# EAGLE design lineFollower (EAGLE 6.5.0)
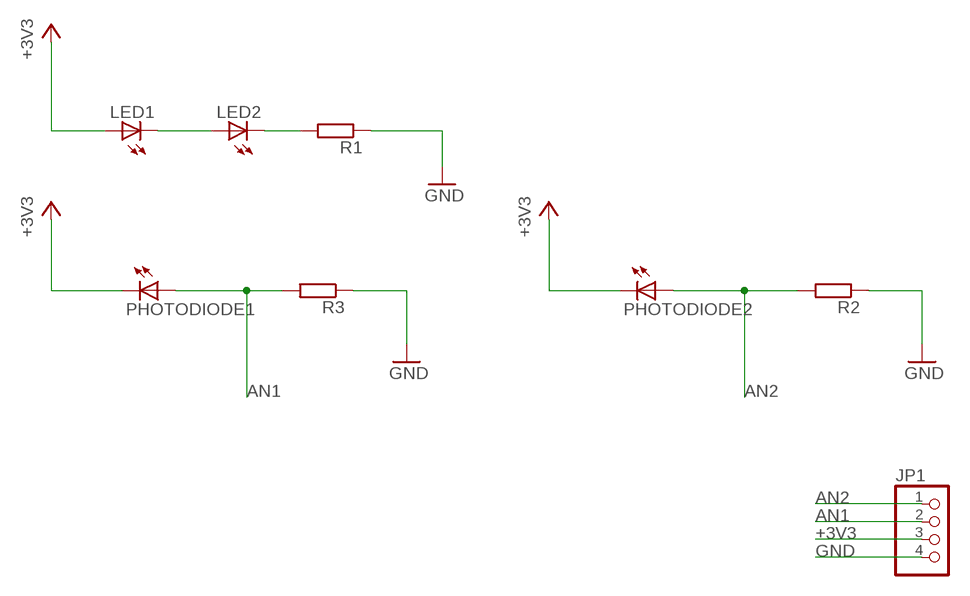
[diagram p0: schematic, sheet 1]

## Parts
JP1  PINHD-1X4  [1X04]
LED1  LED  [LED3MM_NARROW]
LED2  LED  [LED3MM_NARROW]
PHOTODIODE1  LED  [LED3MM_NARROW]
PHOTODIODE2  LED  [LED3MM_NARROW]
R1  R-EU_0204/5  [0204/5]
R2  R-EU_0204/5  [0204/5]
R3  R-EU_0204/5  [0204/5]

## Nets
+3V3: JP1.3 LED1.A PHOTODIODE1.K(C) PHOTODIODE2.K(C)
AN1: JP1.2 PHOTODIODE1.A R3.2
AN2: JP1.1 PHOTODIODE2.A R2.2
GND: JP1.4 R1.1 R2.1 R3.1
N$1: LED1.K(C) LED2.A
N$2: LED2.K(C) R1.2

## Library data of the parts
JP1 = Child-Friendly-Parts:PINHD-1X4: PIN HEADER
LED1 LED2 PHOTODIODE1 PHOTODIODE2 = Child-Friendly-Parts:LED: LED
R1-R3 = Child-Friendly-Parts:R-EU_: RESISTOR, European symbol

## Board
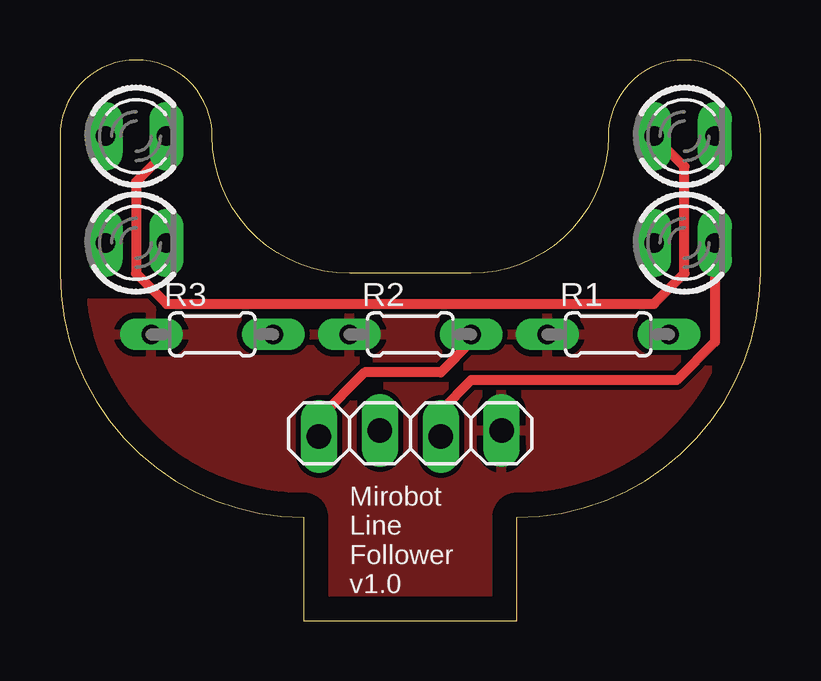
[diagram p1: board, top side]
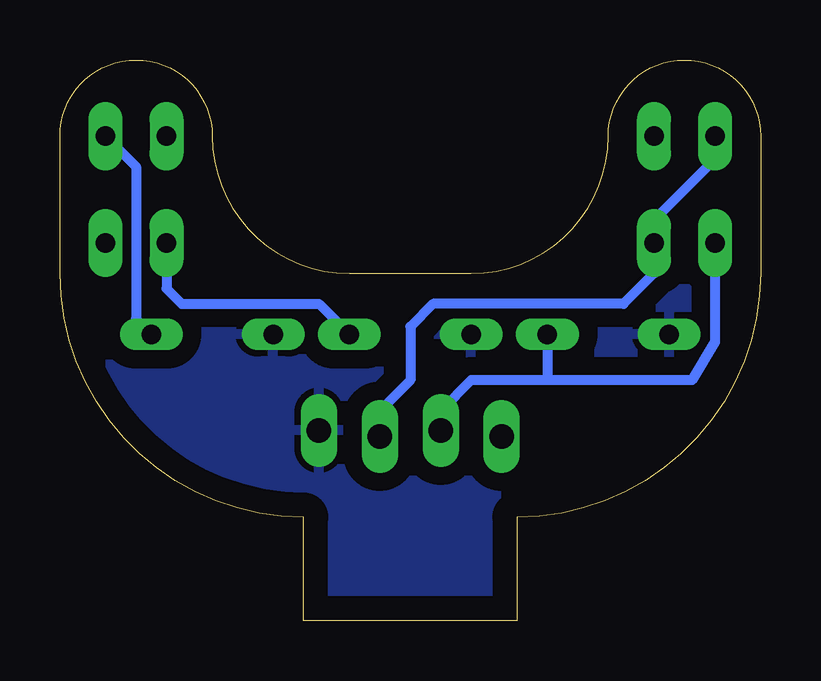
[diagram p2: board, bottom side, seen from below]

Size 29.21 x 23.37 mm. Coordinates in mm from the lower left corner, seen from the top.
Outline: 10.16,0 19.05,0 19.05,4.32 arc90 29.21,14.48 29.21,20.19 arc90 26.04,23.37 arc90 22.86,20.19 arc-90 17.14,14.48 12.07,14.48 arc-90 6.35,20.19 arc90 3.17,23.37 arc90 0,20.19 0,14.48 arc90 10.16,4.32 10.16,0
Copper layers (1*16): Top 0.035mm / dielectric 1.5mm / Bottom 0.035mm
Design rules "default": minimum track width 10mil, minimum drill 24mil, track to track 8mil, track to pad 8mil, pad to pad 8mil, via to via 8mil, smd to smd 8mil, copper to edge 40mil, drill to drill 8mil, minimum pad ring 10mil, minimum via ring 8mil, stop-mask expansion 4mil, vias tented up to drill 0mil, thermal gap 10mil

### Footprints (pad centres in the part's own frame; a part is rotated, then mirrored left to right if it is on the bottom)
1X04 = drill 1.016 long: 1 -3.81,-0.127; 2 -1.27,0.127; 3 1.27,-0.127; 4 3.81,0.127
LED3MM_NARROW = drill 0.813 pad 1.422 long: A -1.27,0; K 1.27,0
0204/5 = drill 0.813 long: 1 -2.54,0; 2 2.54,0

### Placement (x,y rotation side)
JP1  14.61,7.81 0 top
LED1  3.17,20.19 0 top
LED2  26.04,20.19 0 top
PHOTODIODE1  3.17,15.75 0 top
PHOTODIODE2  26.04,15.75 0 top
R1  22.86,11.94 0 top
R2  14.61,11.94 0 top
R3  6.35,11.94 0 top

### Tracks (layer width: path | path; a pad name or v marks a point on that pad's centre or on a via)
+3V3
  Top 0.406: PHOTODIODE2.K 27.3,11.62 25.72,10.03 17.14,10.03 15.88,8.76 JP1.3
  Bottom 0.406: LED1.A 1.9,19.24 4.45,16.7 PHOTODIODE1.K 4.45,14.48 5.71,13.21 13.65,13.21 14.61,12.26 14.61,10.03 15.88,8.76 JP1.3
AN1
  Bottom 0.406: R3.2 8.89,10.03 | 8.89,10.03 12.07,10.03 13.34,8.76 JP1.2 | PHOTODIODE1.A 1.9,11.62 2.86,10.03 8.89,10.03
AN2
  Top 0.406: R2.2 17.14,11.62 15.88,10.35 12.7,10.35 10.79,8.45 JP1.1
  Bottom 0.406: PHOTODIODE2.A 24.77,13.84 24.13,13.21 18.41,13.21 R2.2
GND
  pour Bottom (isolate 0.762): -1.27,13.84 -1.27,-0.76 30.48,-0.76 30.48,13.84
  pour Top: -1.27,13.21 -1.27,-0.76 30.48,-0.76 30.48,13.21
N$1
  Top 0.406: LED1.K 4.45,19.56 3.17,18.29 3.17,14.48 4.45,13.21 24.77,13.21 26.04,14.48 26.04,18.92 LED2.A
N$2
  Bottom 0.406: LED2.K 26.04,18.92 26.04,12.57 R1.2

### Text on the board
tNames: Mirobot / Line / Follower / v1.0